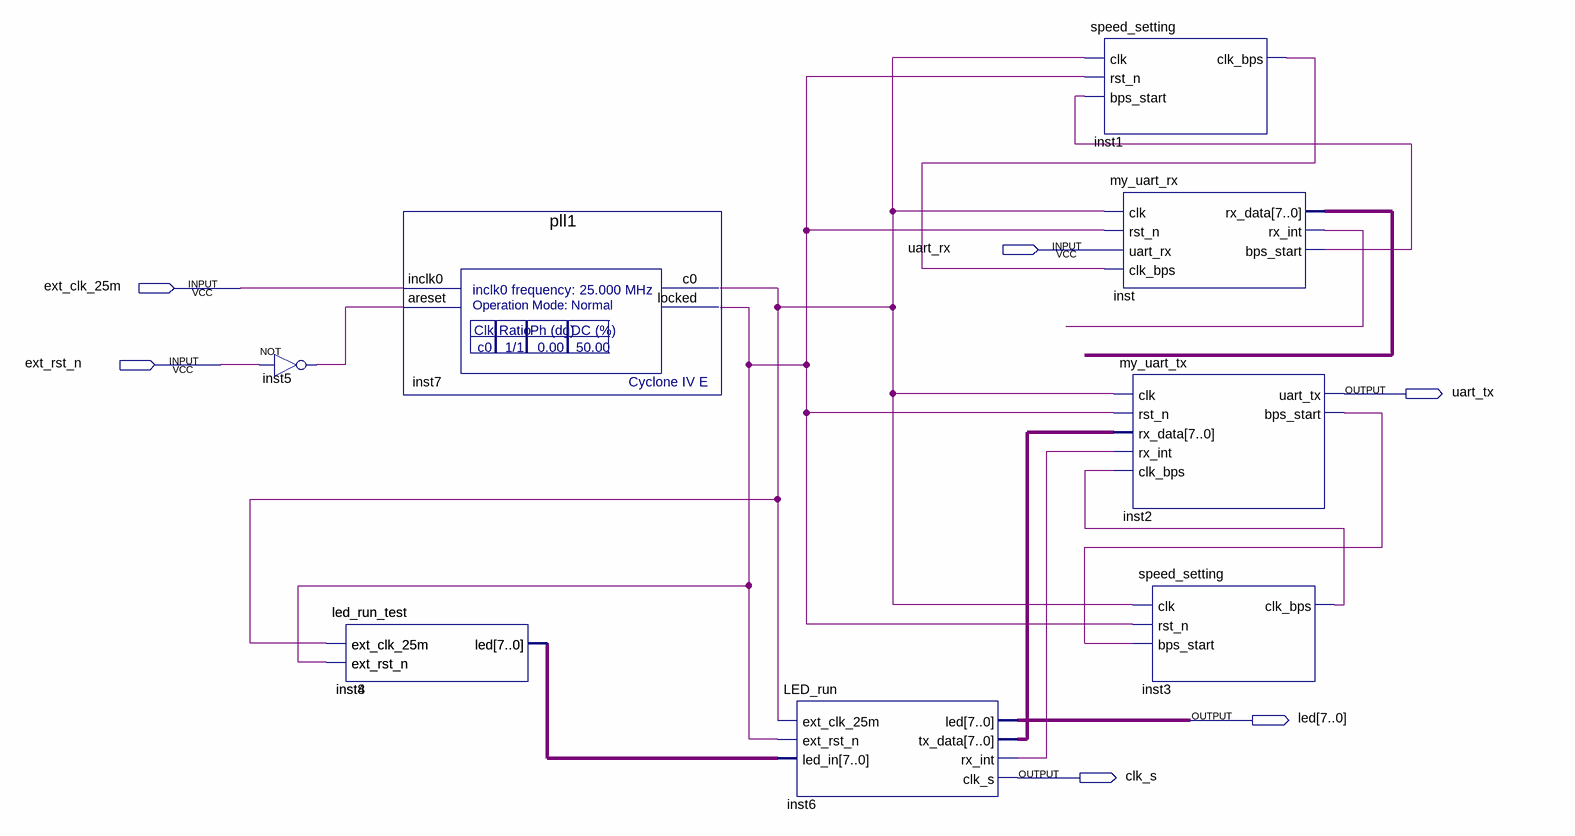
[diagram p0: schematic sheet]
// Quartus schematic cv4.bdf as structural Verilog: 9 symbols, 6 pins
module cv4 (
  input  uart_rx,
  input  ext_clk_25m,
  input  ext_rst_n,
  output uart_tx,
  output [7:0] led,
  output clk_s
);

  wire inst1_clk_bps, inst2_bps_start, inst3_clk_bps, inst5_out, inst6_rx_int, inst7_c0, inst7_locked,
       inst_bps_start, inst_rx_int;
  wire [7:0] inst4_led, inst6_tx_data, inst_rx_data;

  not inst5 (inst5_out, ext_rst_n);
  led_run_test inst4 (.ext_clk_25m(inst7_c0), .ext_rst_n(inst7_locked), .led(inst4_led));
  led_run_test inst8 (.ext_clk_25m(inst7_c0), .ext_rst_n(inst7_locked), .led(inst4_led));
  pll1 inst7 (.inclk0(ext_clk_25m), .areset(inst5_out), .c0(inst7_c0), .locked(inst7_locked));
  LED_run inst6 (
    .ext_clk_25m(inst7_c0), .ext_rst_n(inst7_locked), .led_in(inst4_led), .led(led), .tx_data(inst6_tx_data),
    .rx_int(inst6_rx_int), .clk_s(clk_s));
  speed_setting inst1 (.clk(inst7_c0), .rst_n(inst7_locked), .bps_start(inst_bps_start), .clk_bps(inst1_clk_bps));
  my_uart_rx inst (
    .clk(inst7_c0), .rst_n(inst7_locked), .uart_rx(uart_rx), .clk_bps(inst1_clk_bps), .rx_data(inst_rx_data),
    .rx_int(inst_rx_int), .bps_start(inst_bps_start));
  my_uart_tx inst2 (
    .clk(inst7_c0), .rst_n(inst7_locked), .rx_data(inst6_tx_data), .rx_int(inst6_rx_int),
    .clk_bps(inst3_clk_bps), .uart_tx(uart_tx), .bps_start(inst2_bps_start));
  speed_setting inst3 (.clk(inst7_c0), .rst_n(inst7_locked), .bps_start(inst2_bps_start), .clk_bps(inst3_clk_bps));
endmodule
